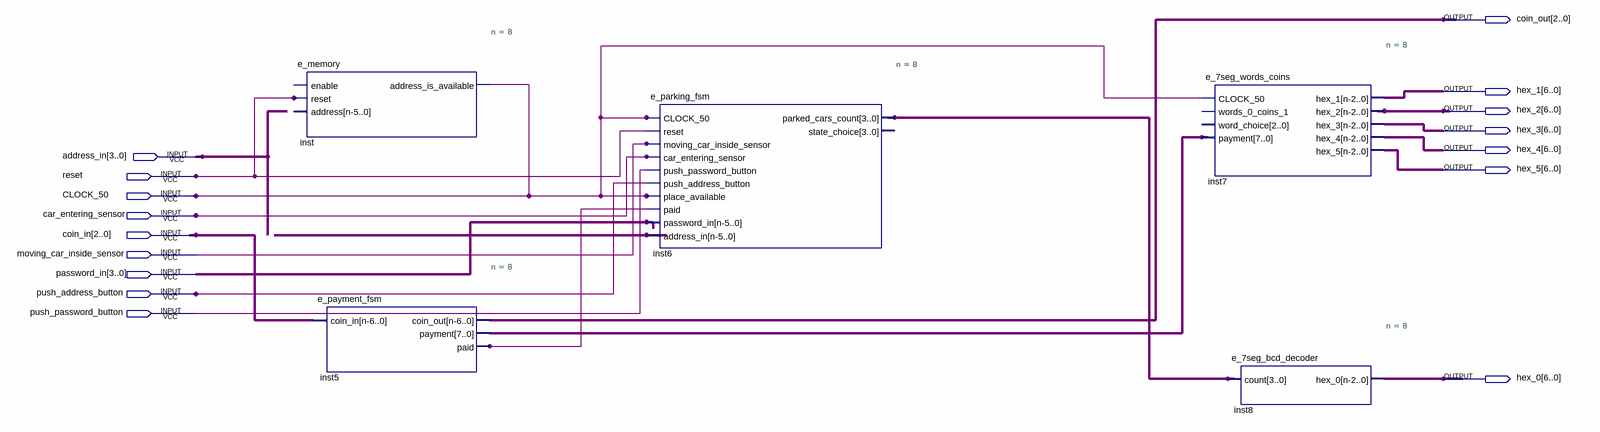
[diagram p0: schematic sheet]
// Quartus schematic Circuit Diagram.bdf as structural Verilog: 5 symbols, 16 pins
module \Circuit_Diagram  (
  input  [3:0] address_in,
  input  reset,
  input  CLOCK_50,
  input  car_entering_sensor,
  input  [2:0] coin_in,
  input  moving_car_inside_sensor,
  input  [3:0] password_in,
  input  push_address_button,
  input  push_password_button,
  output [2:0] coin_out,
  output [6:0] hex_1,
  output [6:0] hex_2,
  output [6:0] hex_3,
  output [6:0] hex_4,
  output [6:0] hex_5,
  output [6:0] hex_0
);

  wire inst5_paid;
  wire [3:0] inst6_parked_cars_count, undriven;
  wire [7:0] inst5_payment;

  e_memory #(.n(8)) inst (.reset(reset), .address_is_available(CLOCK_50));  // open: enable, address
  e_payment_fsm #(.n(8)) inst5 (.coin_in(coin_in), .coin_out(coin_out), .payment(inst5_payment), .paid(inst5_paid));
  e_parking_fsm #(.n(8)) inst6 (
    .CLOCK_50(CLOCK_50), .reset(reset), .moving_car_inside_sensor(moving_car_inside_sensor),
    .car_entering_sensor(car_entering_sensor), .push_password_button(push_password_button),
    .push_address_button(push_address_button), .place_available(CLOCK_50), .paid(inst5_paid),
    .password_in(password_in), .address_in(undriven), .parked_cars_count(inst6_parked_cars_count));  // open: state_choice
  e_7seg_words_coins #(.n(8)) inst7 (
    .CLOCK_50(CLOCK_50), .payment(inst5_payment), .hex_1(hex_1), .hex_2(hex_2), .hex_3(hex_3), .hex_4(hex_4),
    .hex_5(hex_5));  // open: words_0_coins_1, word_choice
  e_7seg_bcd_decoder #(.n(8)) inst8 (.count(inst6_parked_cars_count), .hex_0(hex_0));
endmodule
